# Altium schematic sheet Э3.SchDoc: Наименование
size 839 x 594 mm; ApprovedBy: Подшивалов; CheckedBy: Подшивалов; Author: Степушин; CompanyName: НИУ ВШЭ МИЭМ; DocumentNumber: 1; SheetNumber: 1; SheetTotal: 1; PageSetup: Record=PageOptions|CenterHorizontal=True|CenterVertical=True|PrintScale=0.94|XCorrection=1.00|YCorrection=1.00|PrintKind=1|BorderSize=5000000|LeftOffset=0|BottomOffset=0|Orientation=1|PaperLength=1000|PaperWidth=1000|Scale=100|PaperSource=7|PrintQuality=-4|MediaType=1|DitherType=10|PaperKind=A4|PrintScaleMode=1; Scale: 1:1; Name1: Отладчик; lit_A: О; Name2: измерительный; DecimalNumber: ЛДПА.758724; DocumentName: Sheet1.SCHDOC
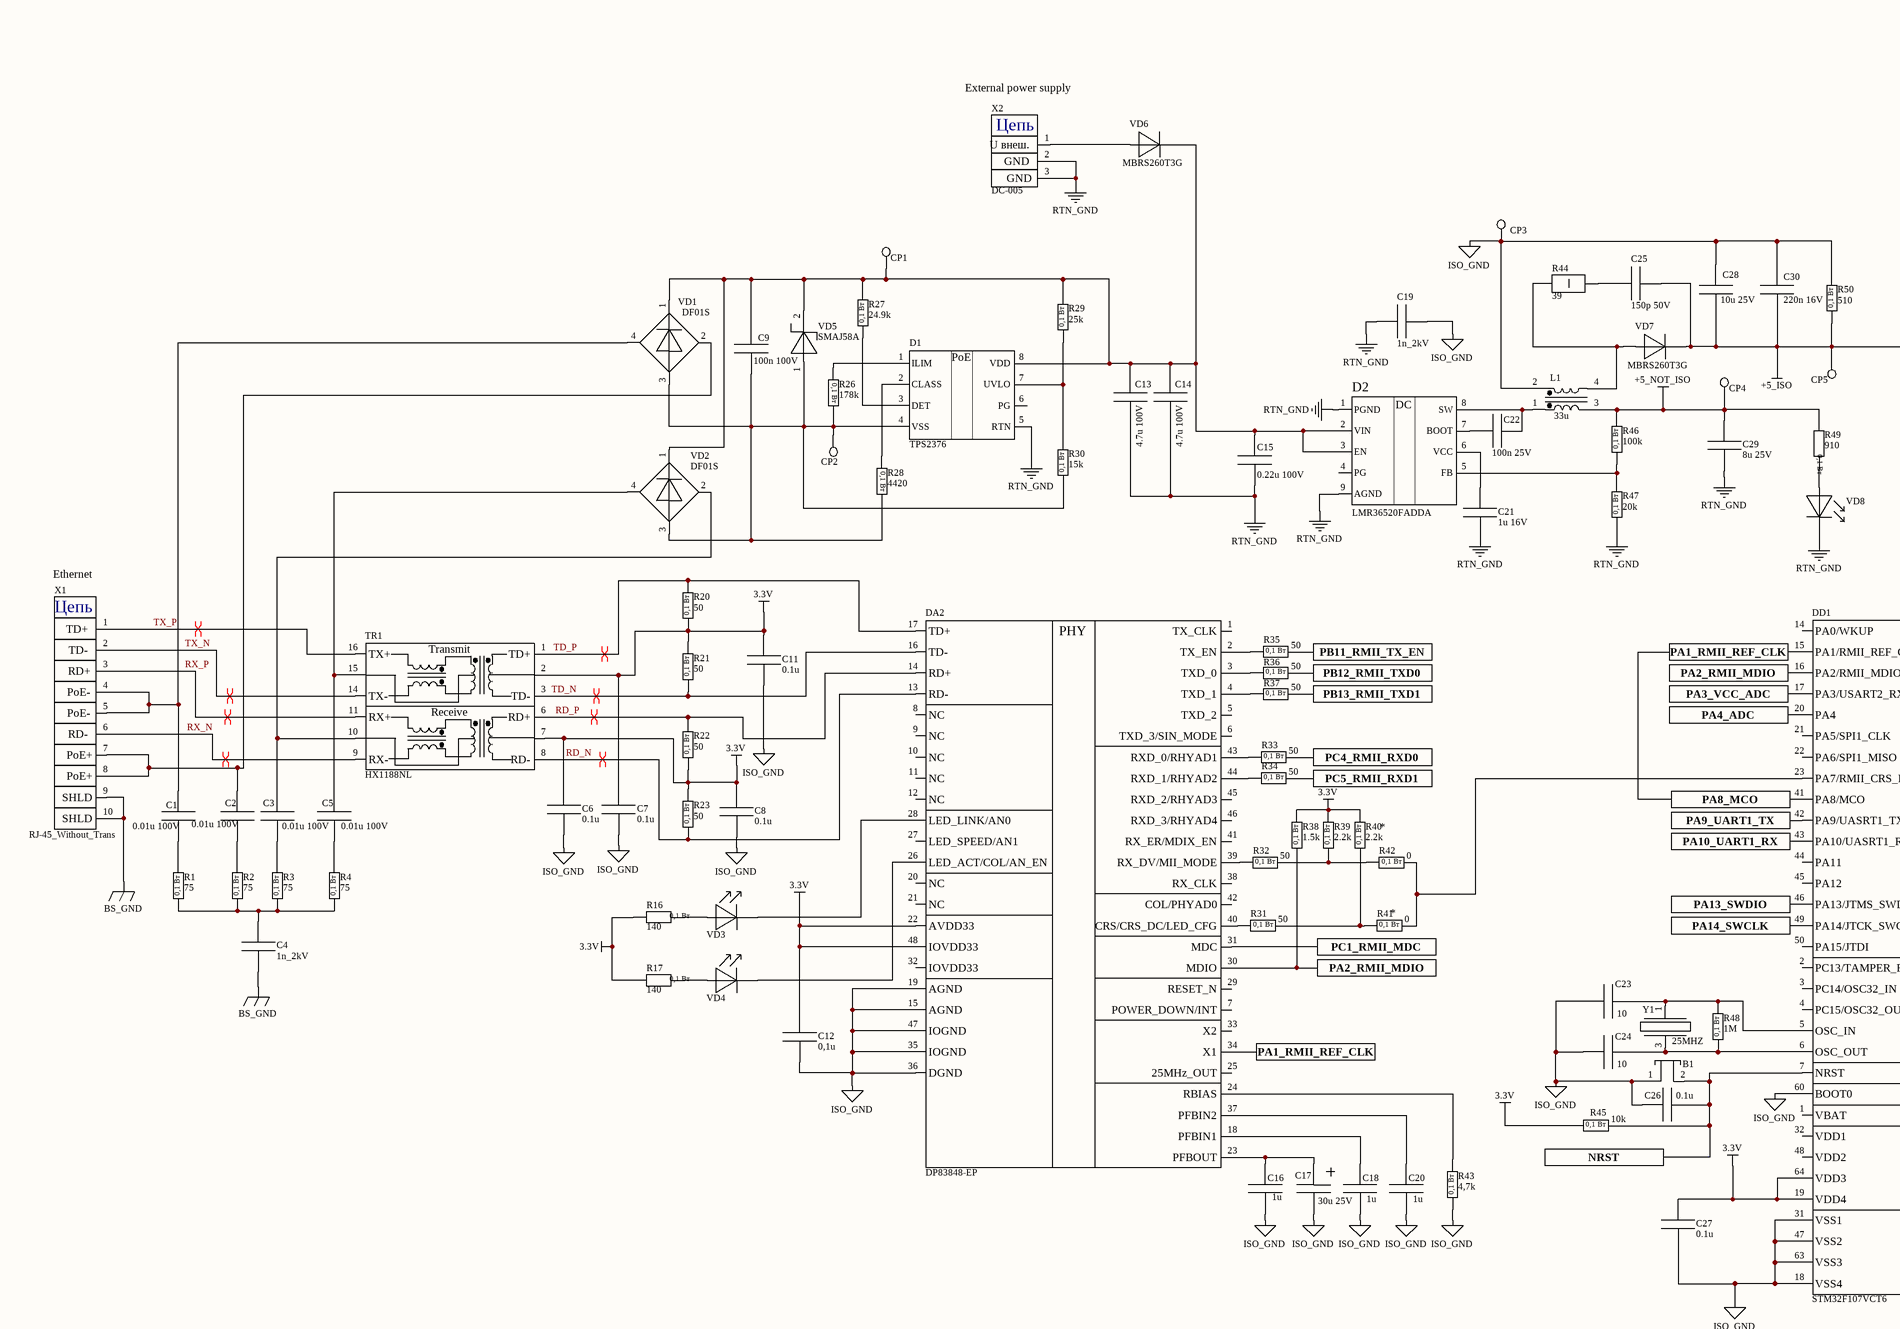
[diagram p0: Э3.SchDoc, top left]
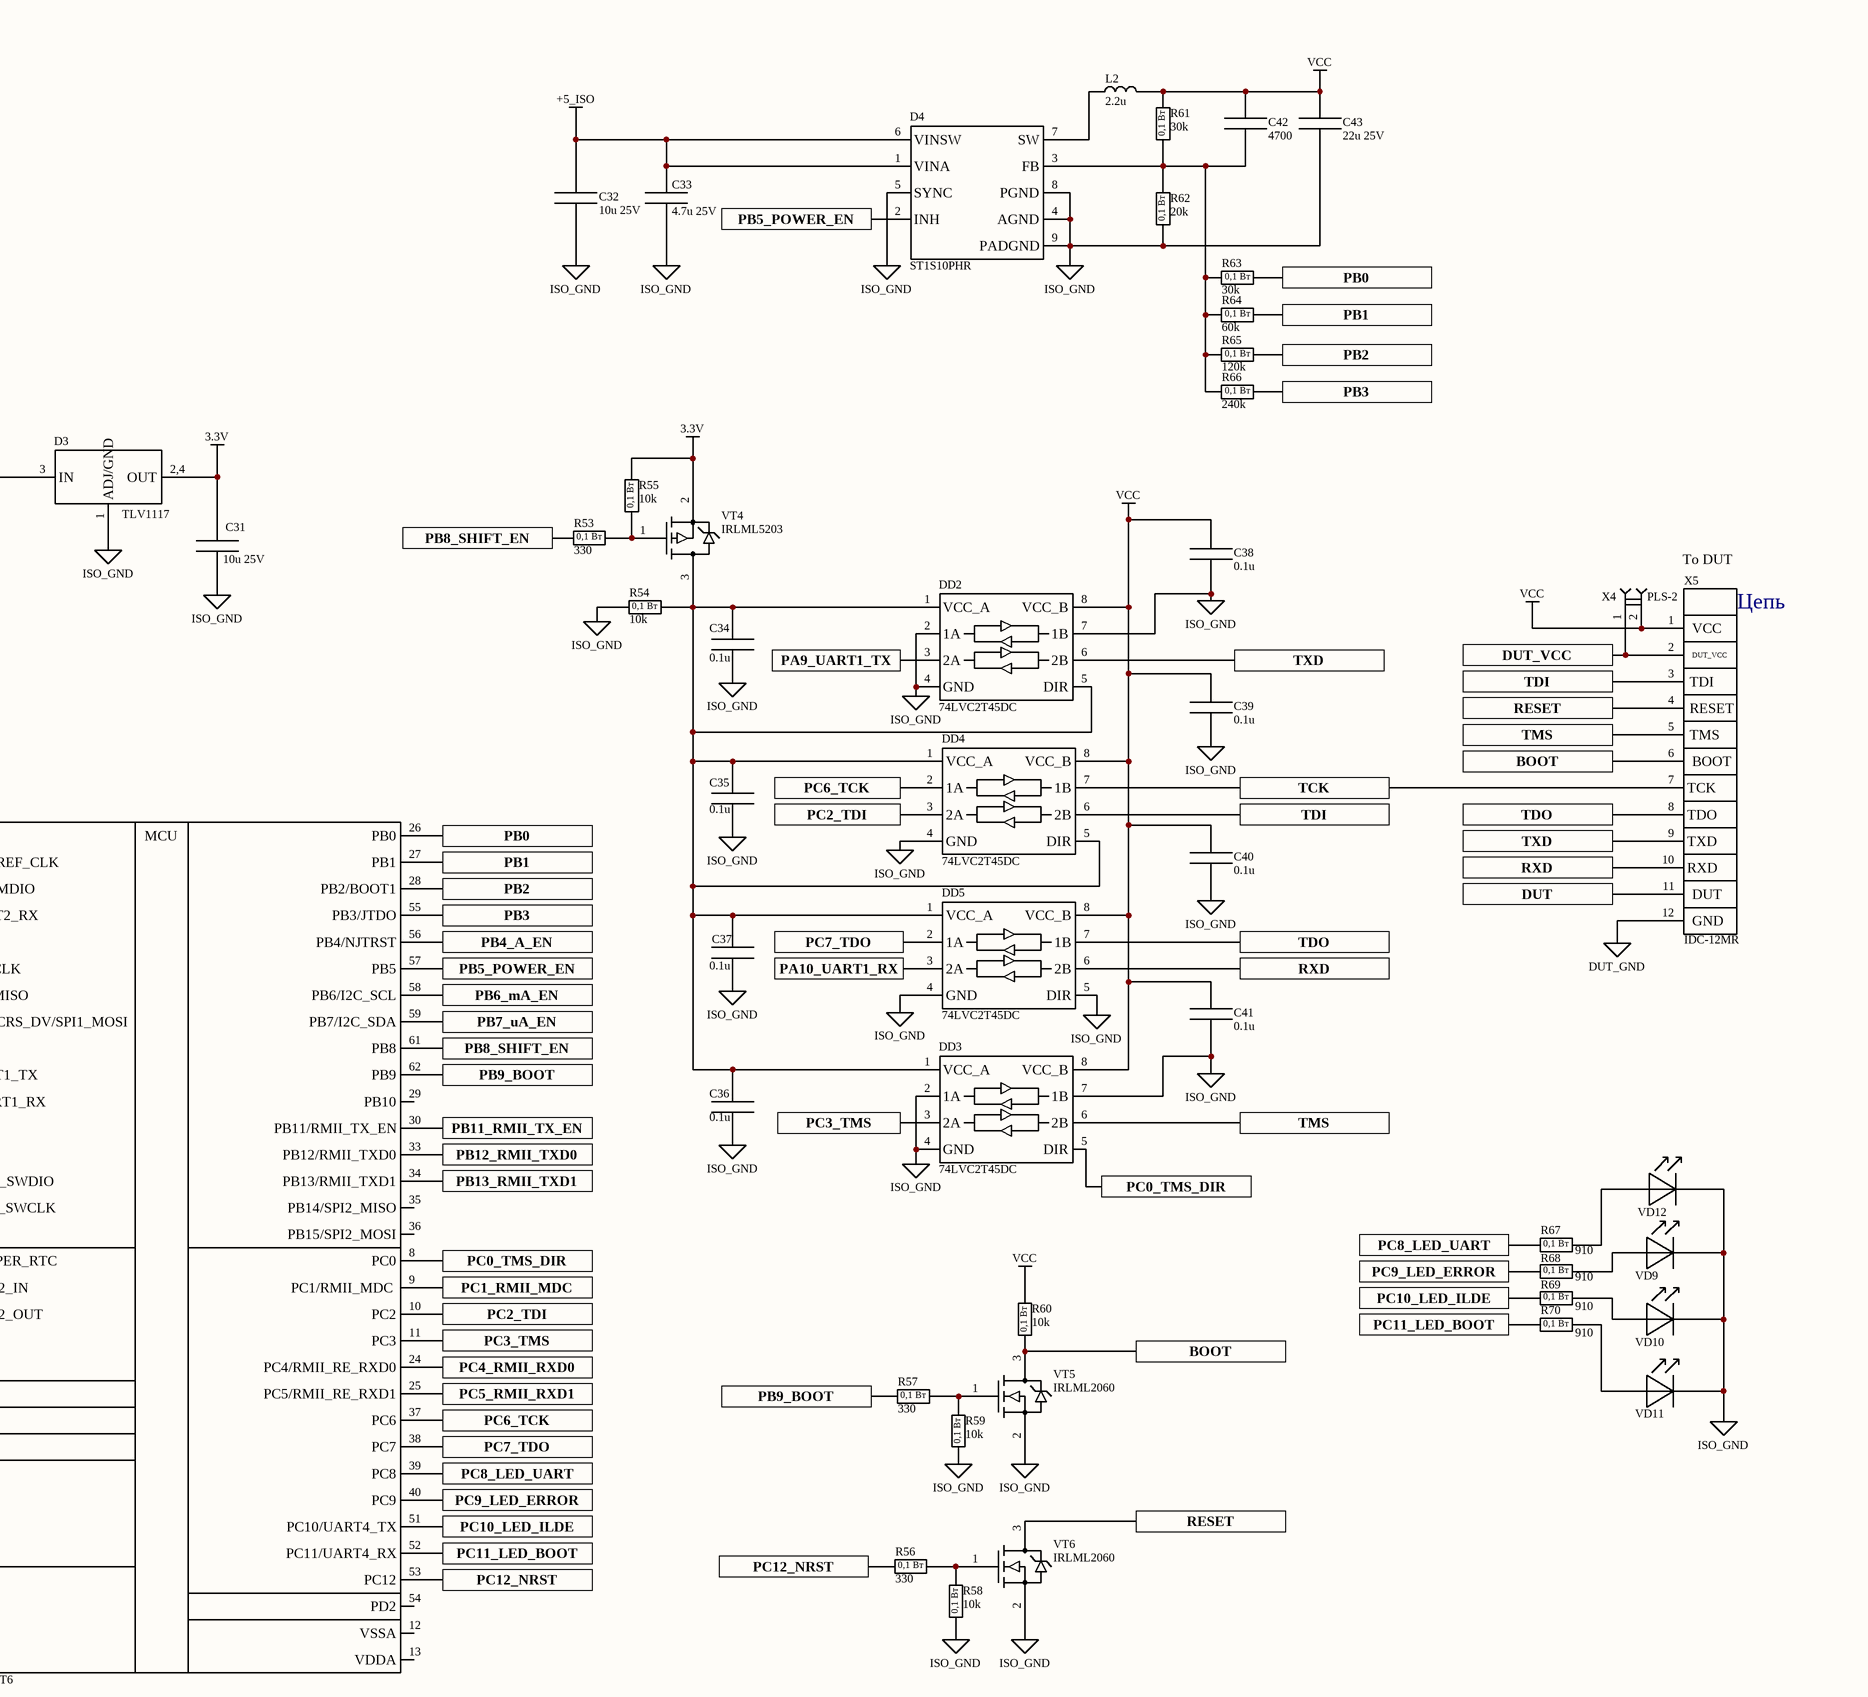
[diagram p1: Э3.SchDoc, top right]
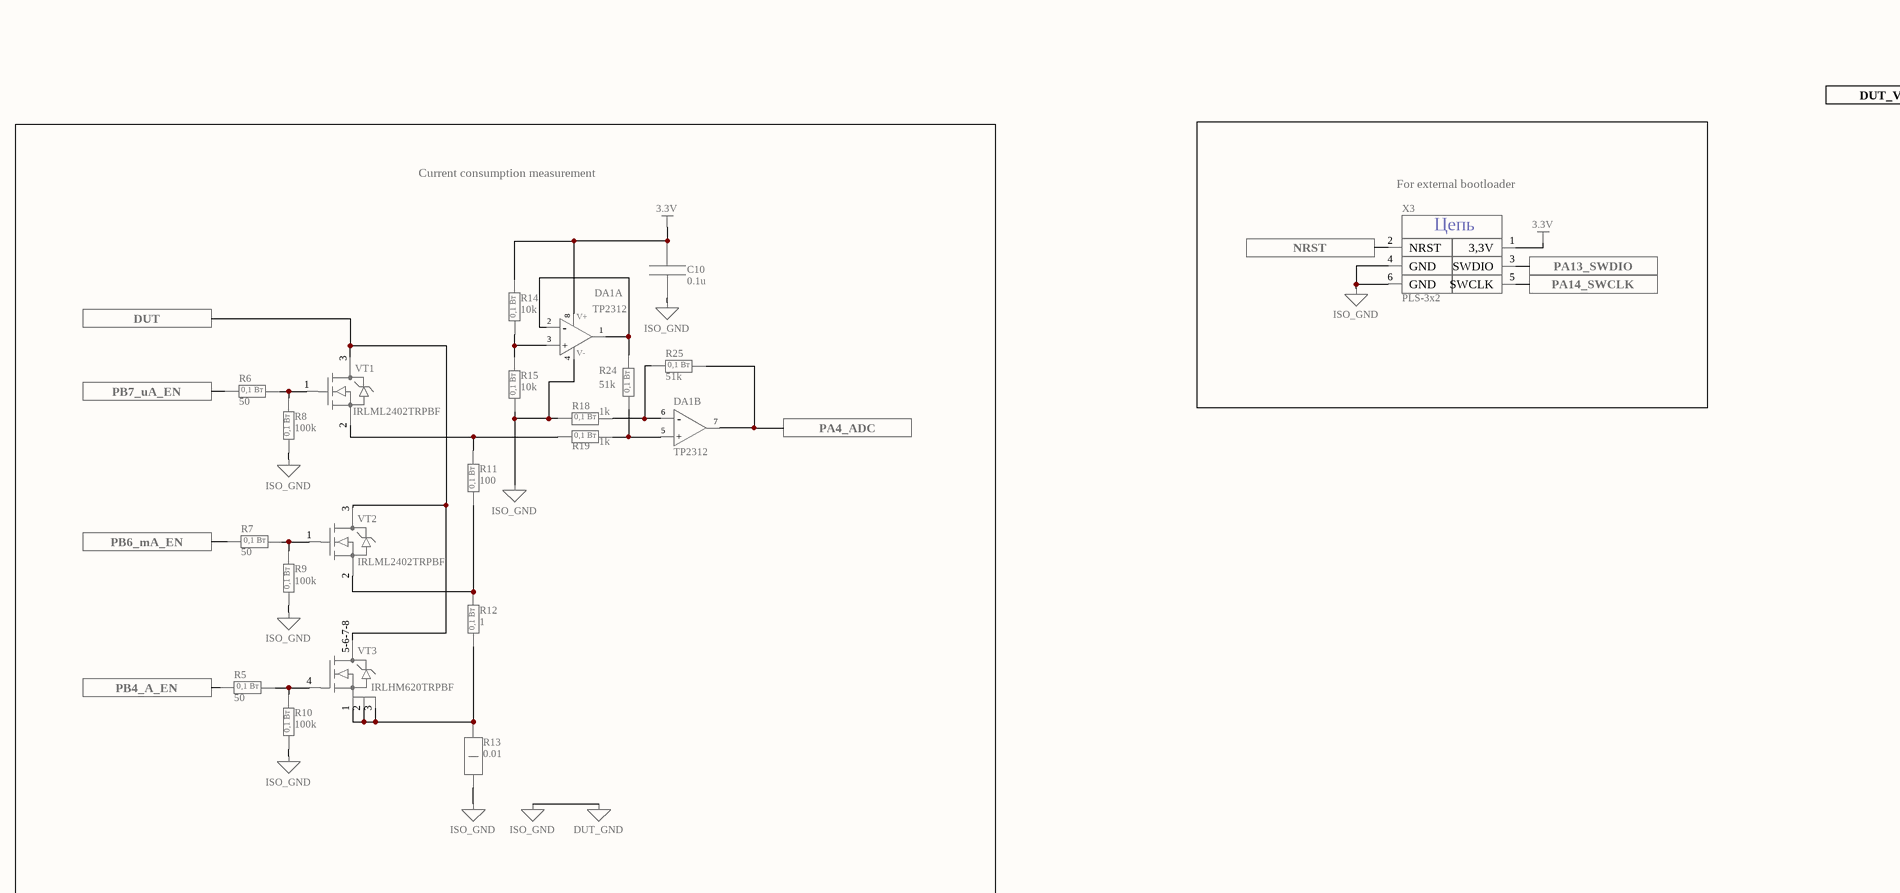
[diagram p2: Э3.SchDoc, bottom left]
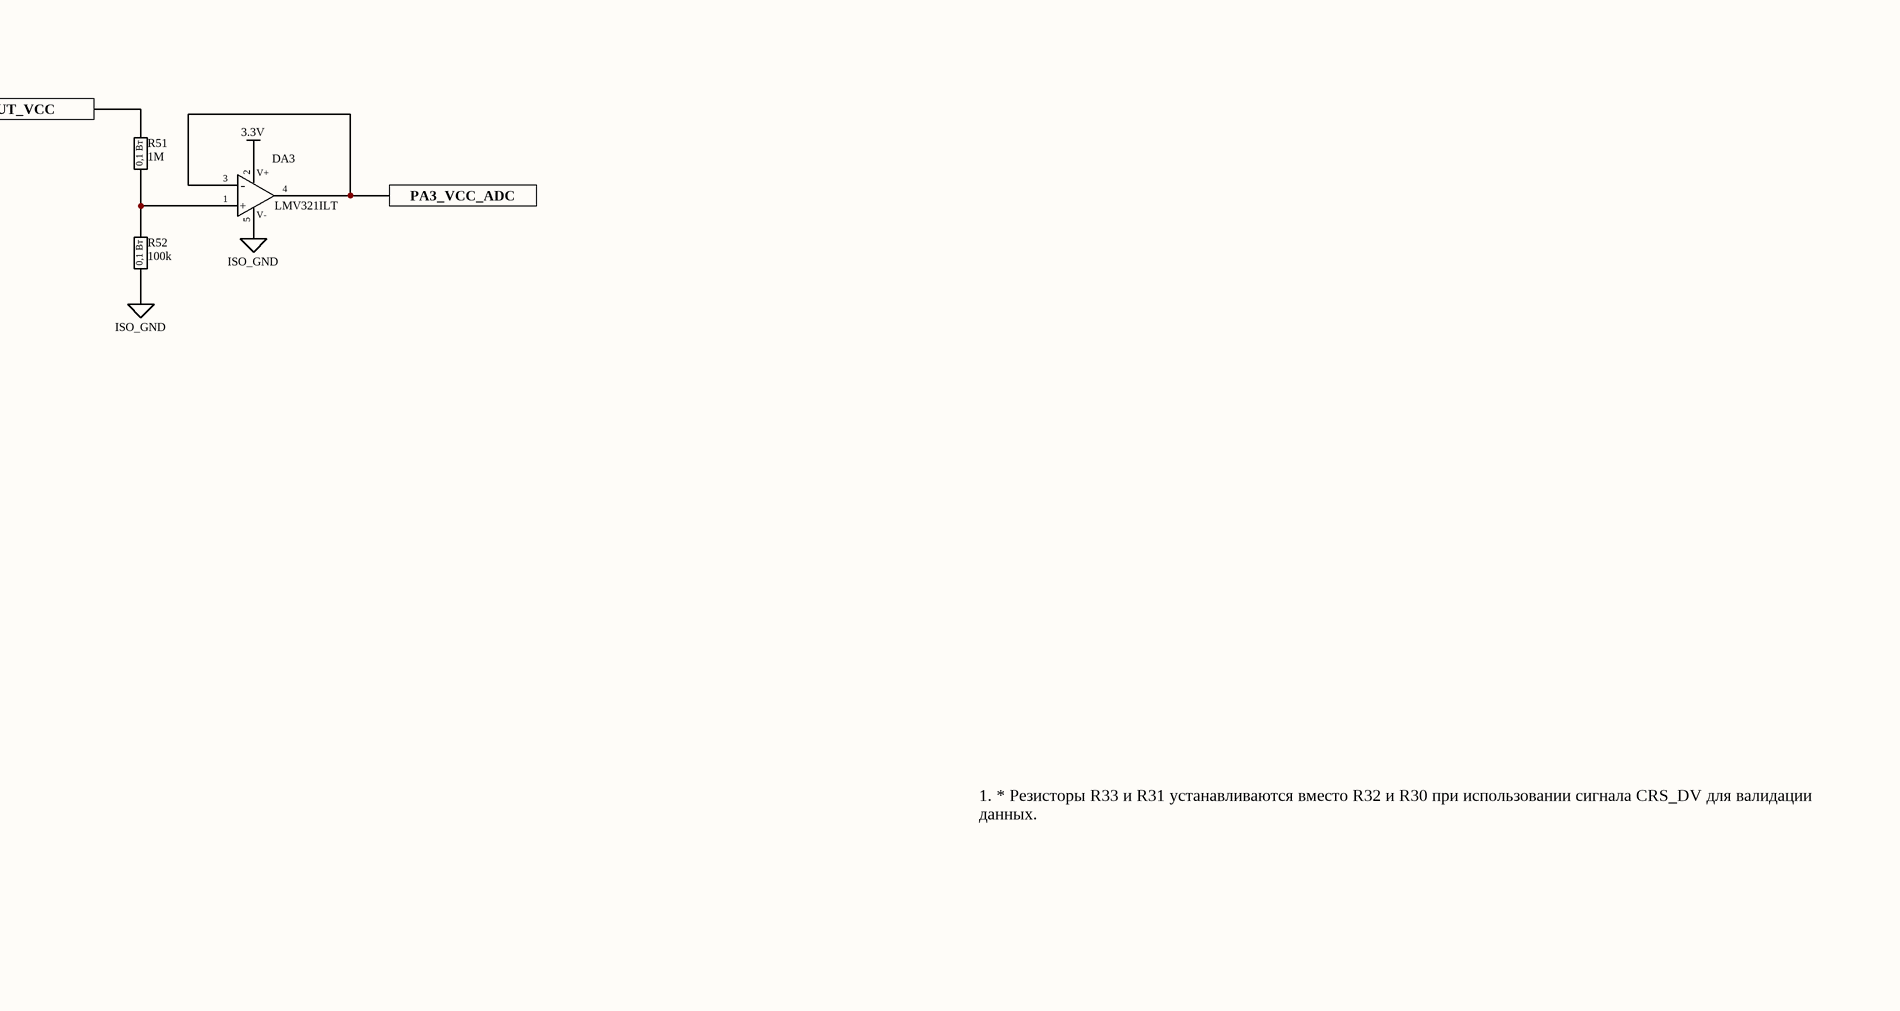
[diagram p3: Э3.SchDoc, bottom right]

## Parts
B1  SMD BUTTON  [L-KLS7-TS3603B-4.3-180-T SWT-10]  (value not drawn)
C1  0.01u 100V  [CAP_0603]
C2  0.01u 100V  [CAP_0603]
C3  0.01u 100V  [CAP_0603]
C4  1n_2kV  [CAP1206]
C5  0.01u 100V  [CAP_0603]
C6  0.1u  [CAP_0603]
C7  0.1u  [CAP_0603]
C8  0.1u  [CAP_0603]
C9  100n 100V  [CAP_0603]
C10  0.1u  [CAP_0603]
C11  0.1u  [CAP_0603]
C12  0,1u  [CAP_0603]
C13  4.7u 100V  [CAP_1210]
C14  4.7u 100V  [CAP_1210]
C15  0.22u 100V  [CAP_0603]
C16  1u  [CAP_0603]
C17  30u 25V  [TANTAL_B]
C18  1u  [CAP_0603]
C19  1n_2kV  [CAP1206]
C20  1u  [CAP_0603]
C21  1u 16V  [CAP_0603]
C22  100n 25V  [CAP_0603]
C23  10  [CAP_0603]
C24  10  [CAP_0603]
C25  150p 50V  [CAP_0603]
C26  0.1u  [CAP_0603]
C27  0.1u  [CAP_0603]
C28  10u 25V  [CAP_1210]
C29  8u 25V  [CAP_1210]
C30  220n 16V  [CAP_0603]
C31  10u 25V  [CAP_1210]
C32  10u 25V  [CAP_1210]
C33  4.7u 25V  [CAP_1210]
C34  0.1u  [CAP_0603]
C35  0.1u  [CAP_0603]
C36  0.1u  [CAP_0603]
C37  0.1u  [CAP_0603]
C38  0.1u  [CAP_0603]
C39  0.1u  [CAP_0603]
C40  0.1u  [CAP_0603]
C41  0.1u  [CAP_0603]
C42  4700  [CAP_0603]
C43  22u 25V  [CAP_1210]
CP1  Control_Point  [Control_Point]  (value not drawn)  (graphical)
CP2  Control_Point  (value not drawn)  (graphical)
CP3  Control_Point  [Control_Point]  (value not drawn)  (graphical)
CP4  Control_Point  [Control_Point]  (value not drawn)  (graphical)
CP5  Control_Point  [Control_Point]  (value not drawn)  (graphical)
D1  TPS2376  [SOP8_TERM]
D2  LMR36520FADDA  [SOP8_TERM]
D3  TLV1117  [R-PDSO-G4]
D4  ST1S10PHR  [SOP8_TERM]
DA1  TP2312  [SOP127P600X175-8N]  (parts A,B of 2)
DA2  DP83848-EP  [TSQFP50P900X900X120_HS-49N]
DA3  LMV321ILT  [SOT23-5]
DD1  STM32F107VCT6  [CQFP50P1200X1200X160-64N]
DD2  74LVC2T45DC  [TSSOP50P310X100-8N]
DD3  74LVC2T45DC  [TSSOP50P310X100-8N]
DD4  74LVC2T45DC  [TSSOP50P310X100-8N]
DD5  74LVC2T45DC  [TSSOP50P310X100-8N]
L1  33u  [MSD1278]
L2  2.2u  [INDUCTOR_7x7]
R1  75  [RES_0603]
R2  75  [RES_0603]
R3  75  [RES_0603]
R4  75  [RES_0603]
R5  50  [RES_0603]
R6  50  [RES_0603]
R7  50  [RES_0603]
R8  100k  [RES_0603]
R9  100k  [RES_0603]
R10  100k  [RES_0603]
R11  100  [RES_0603]
R12  1  [RES_0603]
R13  0.01  [RES_2512]
R14  10k  [RES_0603]
R15  10k  [RES_0603]
R16  140  [RES_0603]
R17  140  [RES_0603]
R18  1k  [RES_0603]
R19  1k  [RES_0603]
R20  50  [RES_0603]
R21  50  [RES_0603]
R22  50  [RES_0603]
R23  50  [RES_0603]
R24  51k  [RES_0603]
R25  51k  [RES_0603]
R26  178k  [RES_0603]
R27  24.9k  [RES_0603]
R28  4420  [RES_0603]
R29  25k  [RES_0603]
R30  15k  [RES_0603]
R31  50  [RES_0603]
R32  50  [RES_0603]
R33  50  [RES_0603]
R34  50  [RES_0603]
R35  50  [RES_0603]
R36  50  [RES_0603]
R37  50  [RES_0603]
R38  1.5k  [RES_0603]
R39  2.2k  [RES_0603]
R40  2.2k  [RES_0603]
R41  0  [RES_0603]
R42  0  [RES_0603]
R43  4,7k  [RES_0603]
R44  39  [RES_2512]
R45  10k  [RES_0603]
R46  100k  [RES_0603]
R47  20k  [RES_0603]
R48  1M  [RES_0603]
R49  910  [RES_0603]
R50  510  [RES_0603]
R51  1M  [RES_0603]
R52  100k  [RES_0603]
R53  330  [RES_0603]
R54  10k  [RES_0603]
R55  10k  [RES_0603]
R56  330  [RES_0603]
R57  330  [RES_0603]
R58  10k  [RES_0603]
R59  10k  [RES_0603]
R60  10k  [RES_0603]
R61  30k  [RES_0603]
R62  20k  [RES_0603]
R63  30k  [RES_0603]
R64  60k  [RES_0603]
R65  120k  [RES_0603]
R66  240k  [RES_0603]
R67  910  [RES_0603]
R68  910  [RES_0603]
R69  910  [RES_0603]
R70  910  [RES_0603]
TR1  HX1188NL  [HX1188NL]
VD1  DF01S  [DF10S]
VD2  DF01S  [DF10S]
VD3  SMD_LED_0603  [SMD_LED_0603]  (value not drawn)
VD4  SMD_LED_0603  [SMD_LED_0603]  (value not drawn)
VD5  SMAJ58A  [SMA]
VD6  MBRS260T3G  [SMB]
VD7  MBRS260T3G  [SMB]
VD8  SMD_LED_0603  [SMD_LED_0603]  (value not drawn)
VD9  SMD_LED_0603  [SMD_LED_0603]  (value not drawn)
VD10  SMD_LED_0603  [SMD_LED_0603]  (value not drawn)
VD11  SMD_LED_0603  [SMD_LED_0603]  (value not drawn)
VD12  SMD_LED_0603  [SMD_LED_0603]  (value not drawn)
VT1  IRLML2402TRPBF  [SOT95P228X110-3N]
VT2  IRLML2402TRPBF  [SOT95P228X110-3N]
VT3  IRLHM620TRPBF  [IRLHM620TRPBF]
VT4  IRLML5203  [SOT95P228X110-3N]
VT5  IRLML2060  [SOT95P228X110-3N]
VT6  IRLML2060  [SOT95P228X110-3N]
X1  RJ-45_Without_Trans  [RJ-45_Wihtout_TRANS]
X2  DC-005  [DC_JACK]
X3  PLS-3x2  [PLS-3x2]
X4  PLS-2  [PLS-2]
X5  IDC-12MR  [IDC-12R]
Y1  25MHZ  [NX3225GA-25MHZ-STD-CRG-2]

## Blocks framed on the sheet
Current consumption measurement: C10 DA1 R5-R15 R18 R19 R24 R25 VT1-VT3
For external bootloader: X3

## Ports
BOOT, DUT, DUT_VCC, NRST, PA1_RMII_REF_CLK, PA2_RMII_MDIO, PA3_VCC_ADC, PA4_ADC, PA8_MCO, PA9_UART1_TX, PA10_UART1_RX, PA13_SWDIO, PA14_SWCLK, PB0, PB1, PB2, PB3, PB4_A_EN, PB5_POWER_EN, PB6_mA_EN, PB7_uA_EN, PB8_SHIFT_EN, PB9_BOOT, PB11_RMII_TX_EN, PB12_RMII_TXD0, PB13_RMII_TXD1, PC0_TMS_DIR, PC1_RMII_MDC, PC2_TDI, PC3_TMS, PC4_RMII_RXD0, PC5_RMII_RXD1, PC6_TCK, PC7_TDO, PC8_LED_UART, PC9_LED_ERROR, PC10_LED_ILDE, PC11_LED_BOOT, PC12_NRST, RESET, RXD, TCK, TDI, TDO, TMS, TXD

## Nets
3.3V: C6.2 C7.2 C8.2 C10.2 C11.2 C12.2 C27.2 C31.2 D3.2,4(OUT) DA1.8(V+) DA2.22(AVDD33) DA2.48(IOVDD33) DA3.2(V+) DD1.19(VDD4) DD1.64(VDD3) R14.2 R16.2 R17.2 R20.1 R21.2 R22.1 R23.2 R38.2 R39.2 R40.2 R45.1 R55.2 TR1.2(GND) TR1.7(GND) VT4.2 X3.1(3,3V)
+5_ISO: C25.2 C28.1 C30.1 C32.2 C33.2 CP5.1 D3.3(IN) D4.1(VINA) D4.6(VINSW) R50.1 VD7.2(C)
+5_NOT_ISO: C29.2 CP4.1 L1.3 R46.2 R49.2
BS_GND: C4.1 X1.9(SHLD) X1.10(SHLD)
DUT_GND: B1.1 C6.1 C7.1 C8.1 C10.1 C11.1 C12.1 C16.1 C17.2(-) C18.1 C19.2 C20.1 C23.1 C24.1 C26.1 C27.1 C28.2 C30.2 C31.1 C32.1 C33.1 C34.2 C35.2 C36.2 C37.2 C38.2 C39.2 C40.2 C41.2 C43.1 CP3.1 D3.1(ADJ/GND) D4.4(AGND) D4.5(SYNC) D4.8(PGND) D4.9(PADGND) DA1.4(V-) DA2.15(AGND) DA2.19(AGND) DA2.35(IOGND) DA2.36(DGND) DA2.47(IOGND) DA3.5(V-) DD1.18(VSS4) DD1.31(VSS1) DD1.47(VSS2) DD1.60(BOOT0) DD1.63(VSS3) DD2.2(1A) DD2.4(GND) DD2.7(1B) DD3.2(1A) DD3.4(GND) DD3.7(1B) DD4.4(GND) DD5.4(GND) DD5.5(DIR) L1.2 R8.1 R9.1 R10.1 R13.1 R15.1 R18.1 R43.1 R50.2 R52.1 R54.1 R58.1 R59.1 R62.1 VD9.2(C) VD10.2(C) VD11.2(C) VD12.2(C) VT5.2 VT6.2 X3.4(GND) X3.6(GND) X5.12(GND)  [also labelled ISO_GND]
RTN_GND: C13.1 C14.1 C15.1 C19.1 C21.1 C29.1 D1.5(RTN) D2.1(PGND) D2.9(AGND) R47.1 VD8.2(C) X2.2(GND) X2.3(GND)
VCC: C38.1 C39.1 C40.1 C41.1 C42.2 C43.2 DD2.8(VCC_B) DD3.8(VCC_B) DD4.8(VCC_B) DD5.8(VCC_B) L2.2 R60.2 R61.2 X4.2 X5.1(VCC)
BOOT: R60.1 VT5.3 X5.6(BOOT) ; port BOOT
DUT: VT1.3 VT2.3 VT3.5-6-7-8(D) X5.11(DUT) ; port DUT
DUT_VCC: R51.2 X4.1 X5.2(DUT_VCC) ; port DUT_VCC
NRST: B1.2 C26.2 DD1.7(NRST) R45.2 X3.2(NRST) ; port NRST
PA1_RMII_REF_CLK: DA2.34(X1) DD1.15(PA1/RMII_REF_CLK) DD1.41(PA8/MCO) ; port PA1_RMII_REF_CLK, port PA8_MCO
PA2_RMII_MDIO: DA2.30(MDIO) DD1.16(PA2/RMII_MDIO) R38.1 ; port PA2_RMII_MDIO
PA3_VCC_ADC: DA3.3(-) DA3.4(OUT) DD1.17(PA3/USART2_RX) ; port PA3_VCC_ADC
PA4_ADC: DA1.7(OUT) DD1.20(PA4) R25.2 ; port PA4_ADC
PA9_UART1_TX: DD1.42(PA9/UASRT1_TX) DD2.3(2A) ; port PA9_UART1_TX
PA10_UART1_RX: DD1.43(PA10/UASRT1_RX) DD5.3(2A) ; port PA10_UART1_RX
PA13_SWDIO: DD1.46(PA13/JTMS_SWDIO) X3.3(SWDIO) ; port PA13_SWDIO
PA14_SWCLK: DD1.49(PA14/JTCK_SWCLK) X3.5(SWCLK) ; port PA14_SWCLK
PB0: DD1.26(PB0) R63.2 ; port PB0
PB1: DD1.27(PB1) R64.2 ; port PB1
PB2: DD1.28(PB2/BOOT1) R65.2 ; port PB2
PB3: DD1.55(PB3/JTDO) R66.2 ; port PB3
PB4_A_EN: DD1.56(PB4/NJTRST) R5.1 ; port PB4_A_EN
PB5_POWER_EN: D4.2(INH) DD1.57(PB5) ; port PB5_POWER_EN
PB6_mA_EN: DD1.58(PB6/I2C_SCL) R7.1 ; port PB6_mA_EN
PB7_uA_EN: DD1.59(PB7/I2C_SDA) R6.1 ; port PB7_uA_EN
PB8_SHIFT_EN: DD1.61(PB8) R53.1 ; port PB8_SHIFT_EN
PB9_BOOT: DD1.62(PB9) R57.1 ; port PB9_BOOT
PB11_RMII_TX_EN: DD1.30(PB11/RMII_TX_EN) R35.2 ; port PB11_RMII_TX_EN
PB12_RMII_TXD0: DD1.33(PB12/RMII_TXD0) R36.2 ; port PB12_RMII_TXD0
PB13_RMII_TXD1: DD1.34(PB13/RMII_TXD1) R37.2 ; port PB13_RMII_TXD1
PC0_TMS_DIR: DD1.8(PC0) DD3.5(DIR) ; port PC0_TMS_DIR
PC1_RMII_MDC: DA2.31(MDC) DD1.9(PC1/RMII_MDC) ; port PC1_RMII_MDC
PC2_TDI: DD1.10(PC2) DD4.3(2A) ; port PC2_TDI
PC3_TMS: DD1.11(PC3) DD3.3(2A) ; port PC3_TMS
PC4_RMII_RXD0: DD1.24(PC4/RMII_RE_RXD0) R33.2 ; port PC4_RMII_RXD0
PC5_RMII_RXD1: DD1.25(PC5/RMII_RE_RXD1) R34.2 ; port PC5_RMII_RXD1
PC6_TCK: DD1.37(PC6) DD4.2(1A) ; port PC6_TCK
PC7_TDO: DD1.38(PC7) DD5.2(1A) ; port PC7_TDO
PC8_LED_UART: DD1.39(PC8) R67.1 ; port PC8_LED_UART
PC9_LED_ERROR: DD1.40(PC9) R68.1 ; port PC9_LED_ERROR
PC10_LED_ILDE: DD1.51(PC10/UART4_TX) R69.1 ; port PC10_LED_ILDE
PC11_LED_BOOT: DD1.52(PC11/UART4_RX) R70.1 ; port PC11_LED_BOOT
PC12_NRST: DD1.53(PC12) R56.1 ; port PC12_NRST
RD_N: DA2.13(RD-) R23.1 TR1.8(RD-)
RD_P: DA2.14(RD+) R22.2 TR1.6(RD+)
RESET: VT6.3 X5.4(RESET) ; port RESET
RX_N: TR1.9(RX-) X1.6(RD-)
RX_P: TR1.11(RX+) X1.3(RD+)
RXD: DD5.6(2B) X5.10(RXD) ; port RXD
TCK: DD4.7(1B) X5.7(TCK) ; port TCK
TD_N: DA2.16(TD-) R21.1 TR1.3(TD-)
TD_P: DA2.17(TD+) R20.2 TR1.1(TD+)
TDI: DD4.6(2B) X5.3(TDI) ; port TDI
TDO: DD5.7(1B) X5.8(TDO) ; port TDO
TMS: DD3.6(2B) X5.5(TMS) ; port TMS
TX_N: TR1.14(TX-) X1.2(TD-)
TX_P: TR1.16(TX+) X1.1(TD+)
TXD: DD2.6(2B) X5.9(TXD) ; port TXD
NetC1_1: C1.1 R1.2
NetC1_2: C1.2 VD1.4 X1.4(PoE-) X1.5(PoE-)
NetC2_1: C2.1 R2.2
NetC2_2: C2.2 VD1.2 X1.7(PoE+) X1.8(PoE+)
NetC3_1: C3.1 R3.2
NetC3_2: C3.2 TR1.10(GND) VD2.2
NetC4_2: C4.2 R1.1 R2.1 R3.1 R4.1
NetC5_1: C5.1 R4.2
NetC5_2: C5.2 TR1.15(GND) VD2.4
NetC9_1: C9.1 CP2.1 D1.4(VSS) R26.2 R28.2 R30.1 VD1.3(-) VD2.3(-) VD5.1(A)
NetC9_2: C9.2 C13.2 C14.2 C15.2 CP1.1 D1.8(VDD) D2.2(VIN) D2.3(EN) R27.2 R29.2 VD1.1(+) VD2.1(+) VD5.2(C) VD6.2(C)
NetC16_2: C16.2 C17.1(+) DA2.23(PFBOUT)
NetC18_2: C18.2 DA2.18(PFBIN1)
NetC20_2: C20.2 DA2.37(PFBIN2)
NetC21_2: C21.2 D2.6(VCC)
NetC22_1: C22.1 D2.8(SW) L1.1
NetC22_2: C22.2 D2.7(BOOT)
NetC23_2: C23.2 DD1.5(OSC_IN) R48.2 Y1.1
NetC24_2: C24.2 DD1.6(OSC_OUT) R48.1 Y1.3
NetC25_1: C25.1 R44.2
NetC34_1: C34.1 C35.1 C36.1 C37.1 DD2.1(VCC_A) DD2.5(DIR) DD3.1(VCC_A) DD4.1(VCC_A) DD4.5(DIR) DD5.1(VCC_A) R54.2 VT4.3
NetC42_1: C42.1 D4.3(FB) R61.1 R62.2 R63.1 R64.1 R65.1 R66.1
NetD1_1: D1.1(ILIM) R26.1
NetD1_2: D1.2(CLASS) R28.1
NetD1_3: D1.3(DET) R27.1
NetD1_7: D1.7(UVLO) R29.1 R30.2
NetD2_5: D2.5(FB) R46.1 R47.2
NetD4_7: D4.7(SW) L2.1
NetDA1_1: DA1.1(OUT) DA1.2(-) R24.2
NetDA1_3: DA1.3(+) R14.1 R15.2
NetDA1_5: DA1.5(+) R19.2 R24.1
NetDA1_6: DA1.6(-) R18.2 R25.1
NetDA2_2: DA2.2(TX_EN) R35.1
NetDA2_3: DA2.3(TXD_0) R36.1
NetDA2_4: DA2.4(TXD_1) R37.1
NetDA2_24: DA2.24(RBIAS) R43.2
NetDA2_26: DA2.26(LED_ACT/COL/AN_EN) VD4.2(C)
NetDA2_28: DA2.28(LED_LINK/AN0) VD3.2(C)
NetDA2_39: DA2.39(RX_DV/MII_MODE) R32.1
NetDA2_40: DA2.40(CRS/CRS_DC/LED_CFG) R31.1
NetDA2_43: DA2.43(RXD_0/RHYAD1) R33.1
NetDA2_44: DA2.44(RXD_1/RHYAD2) R34.1
NetDA3_1: DA3.1(+) R51.1 R52.2
NetDD1_23: DD1.23(PA7/RMII_CRS_DV/SPI1_MOSI) R41.2 R42.2
NetL1_4: L1.4 R44.1 VD7.1(A)
NetR5_2: R5.2 R10.2 VT3.4(G)
NetR6_2: R6.2 R8.2 VT1.1
NetR7_2: R7.2 R9.2 VT2.1
NetR11_1: R11.1 R12.2 VT2.2
NetR11_2: R11.2 R19.1 VT1.2
NetR12_1: R12.1 R13.2 VT3.1(S) VT3.2(S) VT3.3(S)
NetR16_1: R16.1 VD3.1(A)
NetR17_1: R17.1 VD4.1(A)
NetR31_2: R31.2 R40.1 R41.1
NetR32_2: R32.2 R39.1 R42.1
NetR49_1: R49.1 VD8.1(A)
NetR53_2: R53.2 R55.1 VT4.1
NetR56_2: R56.2 R58.2 VT6.1
NetR57_2: R57.2 R59.2 VT5.1
NetR67_2: R67.2 VD12.1(A)
NetR68_2: R68.2 VD9.1(A)
NetR69_2: R69.2 VD10.1(A)
NetR70_2: R70.2 VD11.1(A)
NetVD6_1: VD6.1(A) X2.1(U_внеш.)

Not connected (* = marked no-connect by the designer): D1 6(PG); D2 4(PG); DA2 1(TX_CLK) 5(TXD_2) 6(TXD_3/SIN_MODE) 7(POWER_DOWN/INT) 8(NC) 9(NC) 10(NC) 11(NC) 12(NC) 20(NC) 21(NC) 25(25MHz_OUT) 27(LED_SPEED/AN1) 29(RESET_N) 32(IOVDD33) 33(X2) 38(RX_CLK) 41(RX_ER/MDIX_EN) 42(COL/PHYAD0) 45(RXD_2/RHYAD3) 46(RXD_3/RHYAD4); DD1 1(VBAT) 2(PC13/TAMPER_RTC) 3(PC14/OSC32_IN) 4(PC15/OSC32_OUT) 12(VSSA) 13(VDDA) 14(PA0/WKUP) 21(PA5/SPI1_CLK) 22(PA6/SPI1_MISO) 29(PB10) 32(VDD1) 35(PB14/SPI2_MISO) 36(PB15/SPI2_MOSI) 44(PA11) 45(PA12) 48(VDD2) 50(PA15/JTDI) 54(PD2)

## Layout directives
differential pair: RD_N, RD_P, RX_N, RX_P, TD_N, TD_P, TX_N, TX_P

## Notes on the sheet
- External power supply
- To DUT
- Ethernet
- *
- (near R41) *
- 1. * Резисторы R33 и R31 устанавливаются вместо R32 и R30 при использовании сигнала CRS_DV для валидации данных.
- Перв.примен.
- Справ.№
- Подп. и дата
- Инв.№ дубл.
- Взам.инв.№
- Подп.и дата
- Разраб.
- Изм.
- Лист
- № докум.
- Подп.
- Дата
- Лит.
- Масштаб
- Масса
- Т.контр.
- Пров.
- СХЕМА   ЭЛЕКТРИЧЕСКАЯ
- ПРИНЦИПИАЛЬНАЯ
- Листов
- Инв.№ подл.
- Утв.
- Н.контр.
- Нач.сект.
- Формат  A1
- (in symbol DC-005) Цепь
- (in symbol DP83848-EP) PHY
- (in symbol HX1188NL) Transmit; Receive
- (in symbol IDC-12MR) Цепь
- (in symbol LMR36520FADDA) DC
- (in symbol PLS-3x2) Цепь
- (in symbol RES_0603) 0,1 Вт
- (in symbol RJ-45_Without_Trans) Цепь
- (in symbol STM32F107VCT6) MCU
- (in symbol TPS2376) PoE

## Library data of the parts
C1-C3 C5-C12 C15 C16 C18 C20-C27 C30 C34-C42 = CAP_0603
C4 C19 = CAP_1206
C13 C14 C28 C29 C31-C33 C43 = CAP_1210
C17 = TANTAL_B
L1 = MSD1278
L2 = INDUCTOR_7x7
R1-R12 R14-R43 R45-R70 = RES_0603
R13 R44 = RES_2512
Y1 = NX3225GA-25MHZ-STD-CRG-2
D1 = TPS2376: ComponentLink1Description: DataSheet; ComponentLink1URL: https://www.ti.com/lit/ds/symlink/tps2377.pdf?ts=1707512337613&ref_url=https%253A%252F%252Fwww.google.com%252F